# EAGLE schematic Robot Board ++ (EAGLE 6.4)
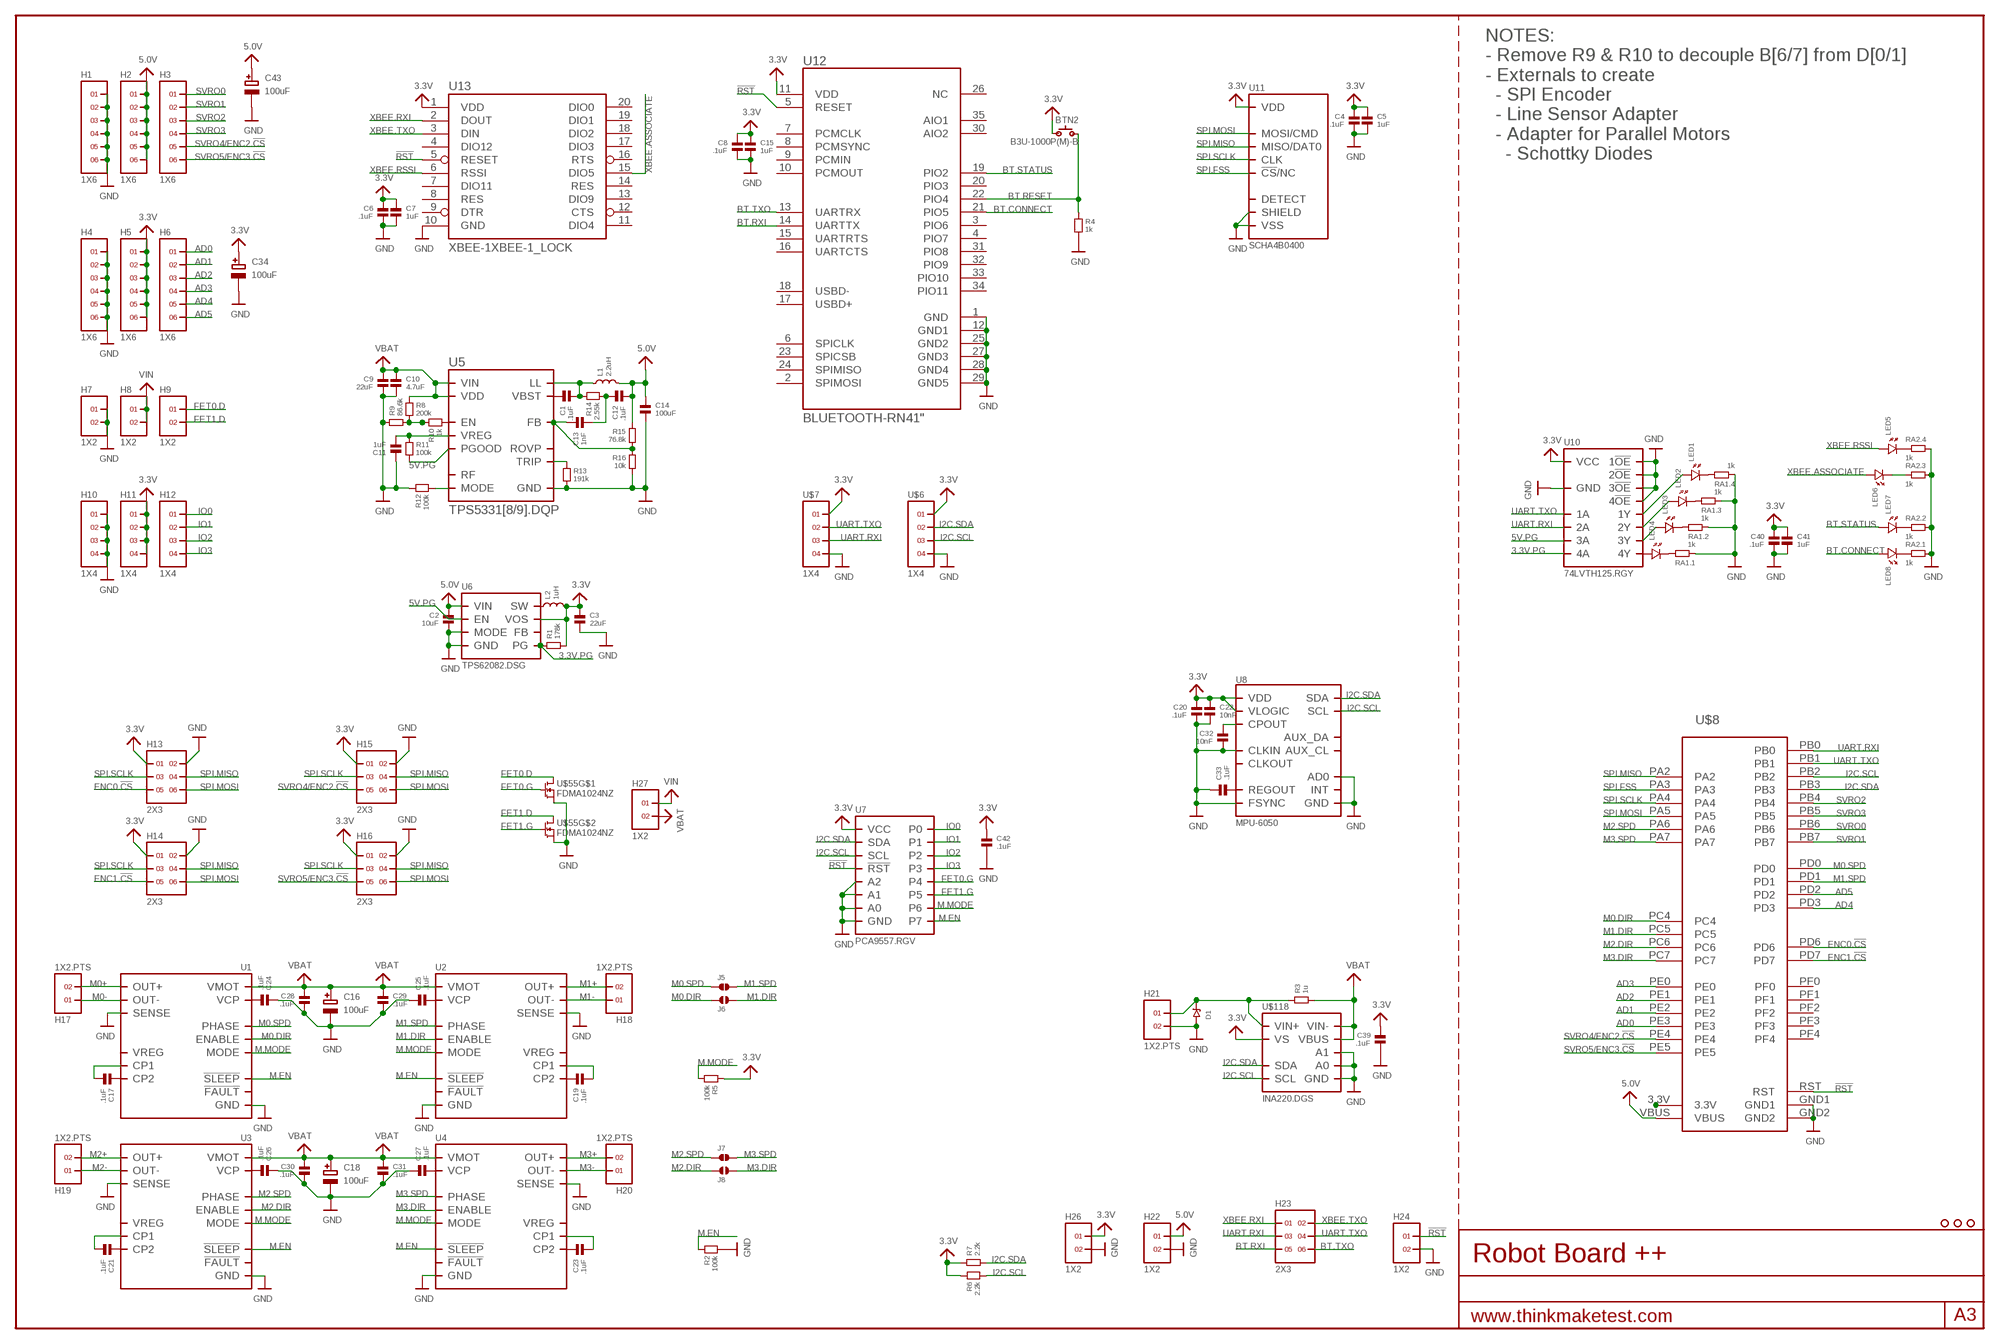
[diagram p0: schematic, sheet 1]

## Parts
BTN2  B3U-1000P(M)-B  SPST.B3U-1000P(M)-B  [B3U-1000P(M)-B]
C1  .1uF  CAPACITOR.0603  [0603]
C2  10uF  CAPACITOR.0603  [0603]
C3  22uF  CAPACITOR.0603  [0603]
C4  .1uF  CAPACITOR.0603  [0603]
C5  1uF  CAPACITOR.0603  [0603]
C6  .1uF  CAPACITOR.0603  [0603]
C7  1uF  CAPACITOR.0603  [0603]
C8  .1uF  CAPACITOR.0603  [0603]
C9  22uF  CAPACITOR.1206  [1206]
C10  4.7uF  CAPACITOR.0805  [0805]
C11  1uF  CAPACITOR.0603  [0603]
C12  .1uF  CAPACITOR.0603  [0603]
C13  1nF  CAPACITOR.0603  [0603]
C14  100uF  CAPACITOR.1210  [1210]
C15  1uF  CAPACITOR.0603  [0603]
C16  100uF  CAP_ELECTROLYTICPANASONIC_C  [PANASONIC_C]
C17  .1uF  CAPACITOR.0603  [0603]
C18  100uF  CAP_ELECTROLYTICPANASONIC_C  [PANASONIC_C]
C19  .1uF  CAPACITOR.0603  [0603]
C20  .1uF  CAPACITOR.0603  [0603]
C21  .1uF  CAPACITOR.0603  [0603]
C22  10nF  CAPACITOR.0603  [0603]
C23  .1uF  CAPACITOR.0603  [0603]
C24  .1uF  CAPACITOR.0603  [0603]
C25  .1uF  CAPACITOR.0603  [0603]
C26  .1uF  CAPACITOR.0603  [0603]
C27  .1uF  CAPACITOR.0603  [0603]
C28  .1uF  CAPACITOR.0603  [0603]
C29  .1uF  CAPACITOR.0603  [0603]
C30  .1uF  CAPACITOR.0603  [0603]
C31  .1uF  CAPACITOR.0603  [0603]
C32  10nF  CAPACITOR.0603  [0603]
C33  .1uF  CAPACITOR.0603  [0603]
C34  100uF  CAP_ELECTROLYTICPANASONIC_C  [PANASONIC_C]
C39  .1uF  CAPACITOR.0603  [0603]
C40  .1uF  CAPACITOR.0603  [0603]
C41  1uF  CAPACITOR.0603  [0603]
C42  .1uF  CAPACITOR.0603  [0603]
C43  100uF  CAP_ELECTROLYTICPANASONIC_C  [PANASONIC_C]
D1  DIODE[SCHOTKY]-SOD123W  [SOD123W]
H1  1X6  [1X6]
H2  1X6  [1X6]
H3  1X6  [1X6]
H4  1X6  [1X6]
H5  1X6  [1X6]
H6  1X6  [1X6]
H7  1X2  [1X2]
H8  1X2  [1X2]
H9  1X2  [1X2]
H10  1X4  [1X4]
H11  1X4  [1X4]
H12  1X4  [1X4]
H13  2X3  [2X3@1]
H14  2X3  [2X3@1]
H15  2X3  [2X3@1]
H16  2X3  [2X3@1]
H17  1X2.PTS  1X2.PTS.PLUG  [PTS.PLUG]
H18  1X2.PTS  1X2.PTS.PLUG  [PTS.PLUG]
H19  1X2.PTS  1X2.PTS.PLUG  [PTS.PLUG]
H20  1X2.PTS  1X2.PTS.PLUG  [PTS.PLUG]
H21  1X2.PTS  1X2.PTS.PLUG  [PTS.PLUG]
H22  1X2  [1X2]
H23  2X3  [2X3]
H24  1X2  [1X2]
H26  1X2  [1X2]
H27  1X2  [1X2]
J5  SOLDERJUMPER.2.LRG  [2.LRG]
J6  SOLDERJUMPER.2.LRG  [2.LRG]
J7  SOLDERJUMPER.2.LRG  [2.LRG]
J8  SOLDERJUMPER.2.LRG  [2.LRG]
L1  2.2uH  INDUCTOR.XAL6030  [XAL6030]
L2  1uH  INDUCTOR-SRN3015  [SRN3015]
LED1  LED.0603  [0603.LED]
LED2  LED.0603  [0603.LED]
LED3  LED.0603  [0603.LED]
LED4  LED.0603  [0603.LED]
LED5  LED.0603  [0603.LED]
LED6  LED.0603  [0603.LED]
LED7  LED.0603  [0603.LED]
LED8  LED.0603  [0603.LED]
R1  178k  RESISTOR.0603  [0603]
R2  100k  RESISTOR.0603  [0603]
R3  1u  RESISTOR.WSK  [0612]
R4  1k  RESISTOR.0603  [0603]
R5  100k  RESISTOR.0603  [0603]
R6  2.2k  RESISTOR.0603  [0603]
R7  2.2k  RESISTOR.0603  [0603]
R8  200k  RESISTOR.0603  [0603]
R9  86.6k  RESISTOR.0603  [0603]
R10  1k  RESISTOR.0603  [0603]
R11  100k  RESISTOR.0603  [0603]
R12  100k  RESISTOR.0603  [0603]
R13  191k  RESISTOR.0603  [0603]
R14  2.55k  RESISTOR.0603  [0603]
R15  76.8k  RESISTOR.0603  [0603]
R16  10k  RESISTOR.0603  [0603]
RA1  1k  RA-4.0603  [0603.4.C]
RA2  1k  RA-4.0603  [0603.4.C]
U1  DRV8800.RTY  [RTY.16]
U2  DRV8800.RTY  [RTY.16]
U3  DRV8800.RTY  [RTY.16]
U4  DRV8800.RTY  [RTY.16]
U5  TPS5331[8/9].DQP  [DQP.22]
U6  TPS62082.DSG  TPS6208X.DSG  [DSG]
U7  PCA9557.RGV  [RGV.16]
U8  MPU-6050  [QFN.24.4X4]
U10  74LVTH125.RGY  74XX125.RGY  [RGY.14]
U11  SCHA4B0400  [SCHA4B0400]
U12  BLUETOOTH-RN41"  [RN41]
U13  XBEE-1XBEE-1_LOCK  [XBEE-1_LOCK]
U$3  HOLE.4MM  [4MM]
U$4  HOLE.4MM  [4MM]
U$6  1X4  [1X4]
U$7  1X4  [1X4]
U$8  STELLARIS-LAUNCHPADSTELLARIS-LAUNCHPAD-XL  [LAUNCHPAD-XL]
U$11  HOLE.4MM  [4MM]
U$55  FDMA1024NZ  [MICROFET.2X2]
U$118  INA220.DGS  [DGS.10]

## Nets
3.3V: BTN2.2 C3.1 C4.1 C5.1 C6.1 C7.1 C8.1 C15.1 C20.1 C22.1 C34.+ C39.1 C40.1 C41.1 C42.1 H5.1 H5.2 H5.3 H5.4 H5.5 H5.6 H11.1 H11.2 H11.3 H11.4 H13.1 H14.1 H15.1 H16.1 H26.1 L2.2 R1.2 R5.1 R6.1 R7.1 U6.5(VOS) U7.14(VCC) U8.8(VLOGIC) U8.13(VDD) U10.14(VCC) U11.VDD U12.11(VDD) U13.1(VDD) U$6.1 U$7.1 U$118.6(VS)
3.3V.PG: R1.1 U6.6(PG) U10.12(4A)
5.0V: C2.1 C12.2 C14.1 C43.+ H2.1 H2.2 H2.3 H2.4 H2.5 H2.6 H22.1 L1.2 R15.1 U6.8(VIN) U$8.VBUS
5V.PG: R11.2 U5.3(PGOOD) U6.1(EN) U10.9(3A)
!RST: H24.1 U7.13(!RST) U12.5(RESET) U13.5(RESET) U$8.RST
AD0: H6.1 U$8.PE3
AD1: H6.2 U$8.PE2
AD2: H6.3 U$8.PE1
AD3: H6.4 U$8.PE0
AD4: H6.5 U$8.PD3
AD5: H6.6 U$8.PD2
BT.CONNECT: LED8.P$1 U12.21(PIO5)
BT.RESET: BTN2.1 R4.1 U12.22(PIO4)
BT.RXI: H23.5 U12.14(UARTTX)
BT.STATUS: LED7.P$1 U12.19(PIO2)
BT.TXO: H23.6 U12.13(UARTRX)
ENC0.!CS: H13.5 U$8.PD6
ENC1.!CS: H14.5 U$8.PD7
FET0.D: H9.1 U$55.6(D) U$55.PAD@1(D)
FET0.G: U7.9(P4) U$55.2(G)
FET1.D: H9.2 U$55.3(D) U$55.PAD@2(D)
FET1.G: U7.10(P5) U$55.5(G)
GND: C2.2 C3.2 C4.2 C5.2 C6.2 C7.2 C8.2 C9.2 C10.2 C11.1 C14.2 C15.2 C16.- C18.- C20.2 C22.2 C24.1 C25.1 C26.1 C27.1 C28.2 C29.2 C30.2 C31.2 C32.2 C33.1 C34.- C39.2 C40.2 C41.2 C42.2 C43.- D1.P$1 H1.1 H1.2 H1.3 H1.4 H1.5 H1.6 H4.1 H4.2 H4.3 H4.4 H4.5 H4.6 H7.1 H7.2 H10.1 H10.2 H10.3 H10.4 H13.2 H14.2 H15.2 H16.2 H21.2 H22.2 H24.2 H26.2 R2.2 R4.2 R9.1 R12.1 R13.2 R16.2 RA1.1 RA1.3 RA1.5 RA1.7 RA2.2 RA2.4 RA2.6 RA2.8 U1.2(GND) U1.7(SENSE) U1.12(GND) U1.PAD(GND) U2.2(GND) U2.7(SENSE) U2.12(GND) U2.PAD(GND) U3.2(GND) U3.7(SENSE) U3.12(GND) U3.PAD(GND) U4.2(GND) U4.7(SENSE) U4.12(GND) U4.PAD(GND) U5.PAD(GND) U6.2(GND) U6.3(MODE) U6.PAD(GND) U7.1(A0) U7.2(A1) U7.3(A2) U7.6(GND) U7.PAD(GND) U8.1(CLKIN) U8.9(AD0) U8.11(FSYNC) U8.18(GND) U10.1(1!OE) U10.4(2!OE) U10.7(GND) U10.10(3!OE) U10.13(4!OE) U10.PAD(GND) U11.GND(VSS) U11.GND@1(VSS) U11.GND@2(VSS) U11.SHIELD U11.SHIELD@1(SHIELD) U11.SHIELD@2(SHIELD) U11.SHIELD@3(SHIELD) U11.VSS U12.1(GND) U12.12(GND1) U12.25(GND2) U12.27(GND3) U12.28(GND4) U12.29(GND5) U13.10(GND) U$6.4 U$7.4 U$8.GND1 U$8.GND2 U$55.1(S) U$55.4(S) U$118.1(A1) U$118.2(A0) U$118.7(GND)
I2C.SCL: R6.2 U7.15(SCL) U8.23(SCL) U$6.3 U$8.PB2 U$118.5(SCL)
I2C.SDA: R7.2 U7.16(SDA) U8.24(SDA) U$6.2 U$8.PB3 U$118.4(SDA)
IO0: H12.1 U7.4(P0)
IO1: H12.2 U7.5(P1)
IO2: H12.3 U7.7(P2)
IO3: H12.4 U7.8(P3)
M0+: H17.2 U1.6(OUT+)
M0-: H17.1 U1.9(OUT-)
M0.DIR: J6.1 U1.4(ENABLE) U$8.PC4
M0.SPD: J5.1 U1.1(PHASE) U$8.PD0
M1+: H18.2 U2.6(OUT+)
M1-: H18.1 U2.9(OUT-)
M1.DIR: J6.2 U2.4(ENABLE) U$8.PC5
M1.SPD: J5.2 U2.1(PHASE) U$8.PD1
M2+: H19.2 U3.6(OUT+)
M2-: H19.1 U3.9(OUT-)
M2.DIR: J8.1 U3.4(ENABLE) U$8.PC6
M2.SPD: J7.1 U3.1(PHASE) U$8.PA6
M3+: H20.2 U4.6(OUT+)
M3-: H20.1 U4.9(OUT-)
M3.DIR: J8.2 U4.4(ENABLE) U$8.PC7
M3.SPD: J7.2 U4.1(PHASE) U$8.PA7
M.EN: R2.1 U1.3(!SLEEP) U2.3(!SLEEP) U3.3(!SLEEP) U4.3(!SLEEP) U7.12(P7)
M.MODE: R5.2 U1.16(MODE) U2.16(MODE) U3.16(MODE) U4.16(MODE) U7.11(P6)
N$1: U$8.3.3V
N$2: C1.1 U5.4(VBST)
N$3: R12.2 U5.20(MODE)
N$4: C11.2 R11.1 U5.18(VREG)
N$5: R13.1 U5.21(TRIP)
N$6: LED1.P$1 U10.3(1Y)
N$7: C33.2 U8.10(REGOUT)
N$8: R10.2 U5.2(EN)
N$9: LED8.P$2 RA2.1
N$10: C13.1 R15.2 R16.1 U5.1(FB)
N$11: R8.2 R9.2 R10.1
N$12: L2.1 U6.7(SW)
N$13: C17.1 U1.11(CP2)
N$14: C12.1 C13.2 R14.2
N$15: C1.2 L1.1 R14.1 U5.6(LL) U5.7(LL) U5.8(LL) U5.9(LL) U5.10(LL) U5.11(LL)
N$18: C24.2 U1.13(VCP)
N$19: C25.2 U2.13(VCP)
N$20: C26.2 U3.13(VCP)
N$21: C27.2 U4.13(VCP)
N$22: D1.P$2 H21.1 R3.1@1 R3.1@2 U$118.10(VIN+)
N$24: C32.1 U8.20(CPOUT)
N$25: C19.1 U2.11(CP2)
N$27: C21.1 U3.11(CP2)
N$29: C23.1 U4.11(CP2)
N$37: C21.2 U3.10(CP1)
N$38: C17.2 U1.10(CP1)
N$39: C19.2 U2.10(CP1)
N$40: C23.2 U4.10(CP1)
N$43: LED2.P$1 U10.6(2Y)
N$44: LED4.P$1 U10.11(4Y)
N$46: LED7.P$2 RA2.3
N$47: LED6.P$2 RA2.5
N$48: LED5.P$2 RA2.7
N$49: LED4.P$2 RA1.2
N$50: LED3.P$1 U10.8(3Y)
N$51: LED1.P$2 RA1.8
N$52: LED2.P$2 RA1.6
N$53: LED3.P$2 RA1.4
SPI.FSS: U11.!CS!/NC/DAT3(!CS!/NC) U$8.PA3
SPI.MISO: H13.4 H14.4 H15.4 H16.4 U11.MISO/DAT0 U$8.PA2
SPI.MOSI: H13.6 H14.6 H15.6 H16.6 U11.MOSI/CMD U$8.PA5
SPI.SCLK: H13.3 H14.3 H15.3 H16.3 U11.CLK U$8.PA4
SVRO0: H3.1 U$8.PB6
SVRO1: H3.2 U$8.PB7
SVRO2: H3.3 U$8.PB4
SVRO3: H3.4 U$8.PB5
SVRO4/ENC2.!CS: H3.5 H15.5 U$8.PE4
SVRO5/ENC3.!CS: H3.6 H16.5 U$8.PE5
UART.RXI: H23.3 U10.5(2A) U$7.3 U$8.PB0
UART.TXO: H23.4 U10.2(1A) U$7.2 U$8.PB1
VBAT: C9.1 C10.1 C16.+ C18.+ C28.1 C29.1 C30.1 C31.1 H27.2 R3.2@1 R3.2@2 R8.1 U1.8(VMOT) U2.8(VMOT) U3.8(VMOT) U4.8(VMOT) U5.12(VIN) U5.13(VIN) U5.14(VIN) U5.15(VIN) U5.16(VIN) U5.17(VIN) U5.19(VDD) U$118.8(VBUS) U$118.9(VIN-)
VIN: H8.1 H8.2 H27.1
XBEE.ASSOCIATE: LED6.P$1 U13.15(DIO5)
XBEE.RSSI: LED5.P$1 U13.6(RSSI)
XBEE.RXI: H23.1 U13.2(DOUT)
XBEE.TXO: H23.2 U13.3(DIN)
Unconnected: U1.14(VREG) U1.15(!FAULT) U2.14(VREG) U2.15(!FAULT) U3.14(VREG) U3.15(!FAULT) U4.14(VREG) U4.15(!FAULT) U5.5(ROVP) U5.22(RF) U6.4(FB) U8.6(AUX_DA) U8.7(AUX_CL) U8.12(INT) U8.22(CLKOUT) U11.CD(DETECT) U12.2(SPIMOSI) U12.3(PIO6) U12.4(PIO7) U12.6(SPICLK) U12.7(PCMCLK) U12.8(PCMSYNC) U12.9(PCMIN) U12.10(PCMOUT) U12.15(UARTRTS) U12.16(UARTCTS) U12.17(USBD+) U12.18(USBD-) U12.20(PIO3) U12.23(SPICSB) U12.24(SPIMISO) U12.26(NC) U12.30(AIO2) U12.31(PIO8) U12.32(PIO9) U12.33(PIO10) U12.34(PIO11) U12.35(AIO1) U13.4(DIO12) U13.7(DIO11) U13.8(RES) U13.9(DTR) U13.11(DIO4) U13.12(CTS) U13.13(DIO9) U13.14(RES) U13.16(RTS) U13.17(DIO3) U13.18(DIO2) U13.19(DIO1) U13.20(DIO0) U$8.PF0 U$8.PF1 U$8.PF2 U$8.PF3 U$8.PF4

## Notes on the sheet
- NOTES:
  - Remove R9 & R10 to decouple B[6/7] from D[0/1]
  - Externals to create
    - SPI Encoder
    - Line Sensor Adapter
    - Adapter for Parallel Motors
      - Schottky Diodes

## Library data of the parts
BTN2 = omron:SPST
C1-C15 C17 C19-C33 C39-C42 = standardparts:CAPACITOR
C16 C18 C34 C43 = microbuilder:CAP_ELECTROLYTIC: Electrolytic Capacitors SMT PANASONIC_C - Size C Panasonic Electrolytic Aluminum Capacitor 47µF 16V 20% Electrolytic Capacitor [Digikey: PCE3890TR-ND] PANASONIC_D - Size D Panasonic Electrolytic Aluminum Capacitor 100µF 25V 20% Electrolytic Capacitor [Digikey: PCE3898TR-ND] PTH 3.5 mm grid, 8 mm diameter ... 3.5 mm grid, 10 mm diameter ...
D1 = nxp:DIODE[SCHOTKY]
H1-H6 = headers(.1in):1X6
H7-H9 H22 H24 H26 H27 = headers(.1in):1X2
H10-H12 U$6 U$7 = headers(.1in):1X4
H13-H16 = headers(.1in):2X3
H17-H21 = phoenixcontact:1X2
H23 = headers(2mm):2X3
J5-J8 = solderjumper:SOLDERJUMPER.2
L1 = coilcraft:INDUCTOR
L2 = bourns:INDUCTOR
LED1-LED8 = standardparts:LED
R1 R2 R4-R16 = standardparts:RESISTOR
R3 = vishay:RESISTOR
RA1 RA2 = resistorarray:RA-4: Dimentions sources from here: http://www.ctscorp.com/components/Datasheets/CTSChipArrayDs.pdf
U1-U4 = packages(ti):DRV8800
U5 = packages(ti):TPS5331[8/9]
U6 = packages(ti):TPS6208X
U7 = packages(ti):PCA9557
U8 = invensense:MPU-6050
U10 = packages(ti):74XX125
U11 = alps:SCHA4B0400
U12 = SparkFun-RF:BLUETOOTH-RN41: Bluetooth SMD module
U13 = SparkFun-RF:XBEE-1: Xbee module footprints SMT header is CONN-09042.
U$3 U$4 U$11 = screw_holes:HOLE
U$8 = StellarisLaunchPad_Fred:STELLARIS-LAUNCHPAD
U$55 = freescale:FDMA1024NZ
U$118 = packages(ti):INA220